# EAGLE design r162dl (EAGLE 5.09)
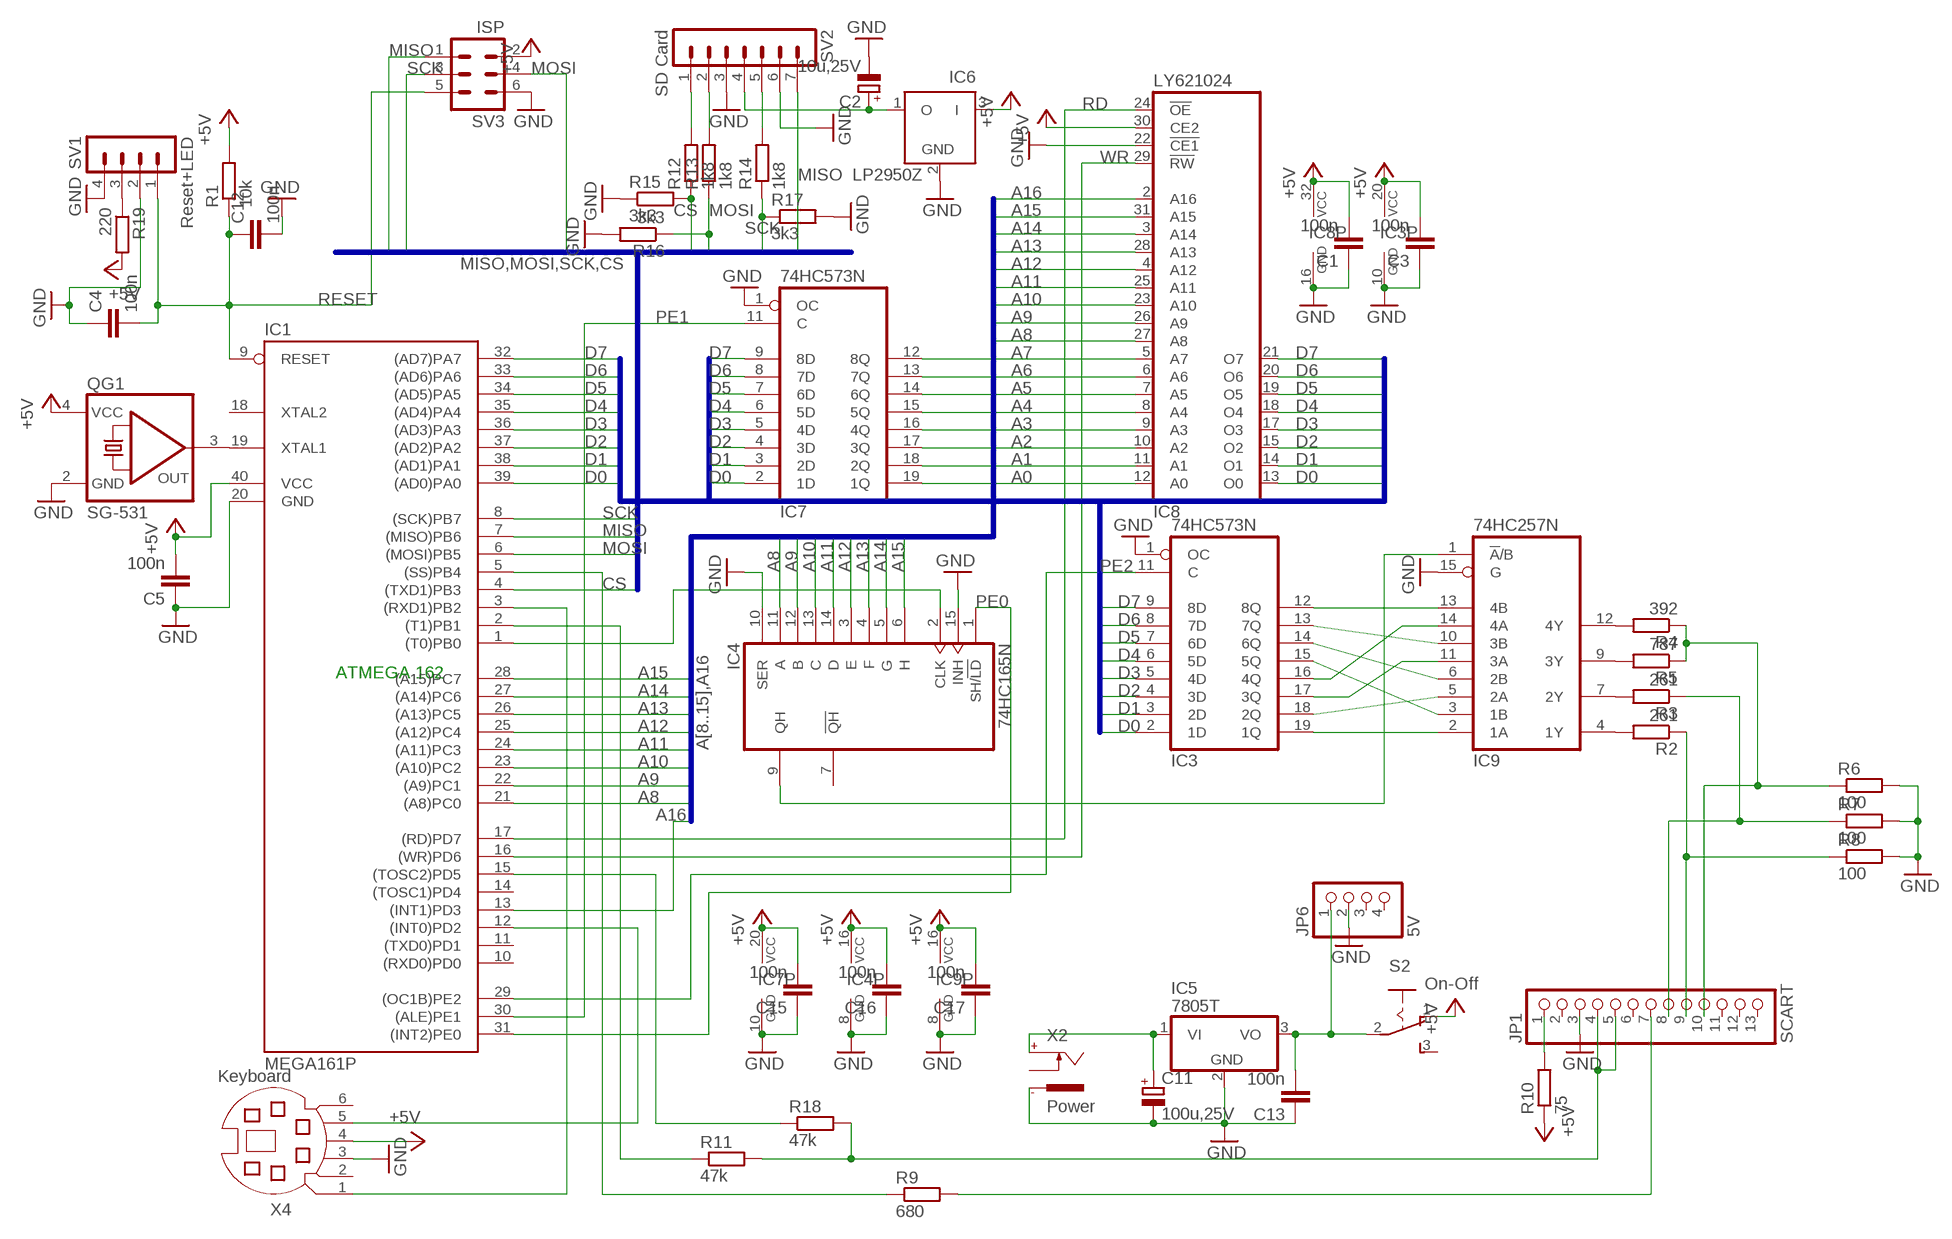
[diagram p0: schematic, sheet 1]

## Parts
C1  100n  C5/3  [C5B3]
C2  10u,25V  CPOL-EUB45181B  [B45181B]
C3  100n  C5/3  [C5B3]
C4  100n  C5/3  [C5B3]
C5  100n  C5/3  [C5B3]
C11  100u,25V  CPOL-EUB45181B  [B45181B]
C12  100n  C5/3  [C5B3]
C13  100n  C5/3  [C5B3]
C15  100n  C5/3  [C5B3]
C16  100n  C5/3  [C5B3]
C17  100n  C5/3  [C5B3]
IC1  MEGA161P  [DIL40]
IC3  74HC573N  [DIL20]
IC4  74HC165N  [DIL16]
IC5  7805T  [TO220H]
IC6  LP2950Z  [TO92]
IC7  74HC573N  [DIL20]
IC8  LY621024  TC551001CP  [DIL32]
IC9  74HC257N  [DIL16]
JP1  SCART  PINHD-1X13_2.00  [1X13M]
JP6  5V  PINHD-1X04_2.54  [1X04]
QG1  SG-531  SG531  [DIL08-4]
R1  10k  R-EU_0207/12  [0207/12]
R2  261  R-EU_0207/12  [0207/12]
R3  261  R-EU_0207/12  [0207/12]
R4  392  R-EU_0207/12  [0207/12]
R5  787  R-EU_0207/12  [0207/12]
R6  100  R-EU_0207/12  [0207/12]
R7  100  R-EU_0207/12  [0207/12]
R8  100  R-EU_0207/12  [0207/12]
R9  680  R-EU_0207/12  [0207/12]
R10  75  R-EU_0207/12  [0207/12]
R11  47k  R-EU_0207/12  [0207/12]
R12  1k8  R-EU_0207/12  [0207/12]
R13  1k8  R-EU_0207/12  [0207/12]
R14  1k8  R-EU_0207/12  [0207/12]
R15  3k3  R-EU_0207/12  [0207/12]
R16  3k3  R-EU_0207/12  [0207/12]
R17  3k3  R-EU_0207/12  [0207/12]
R18  47k  R-EU_0207/12  [0207/12]
R19  220  R-EU_0207/12  [0207/12]
S2  On-Off  M251  [M251]
SV1  Reset+LED  MA04-1  [MA04-1]
SV2  SD Card  MA07-1  [MA07-1]
SV3  ISP  MA03-2  [MA03-2]
X2  Power  737992-55  [737992-5]
X4  Keyboard  MD06SS  [MDIN06SS]

## Nets
+5V [power]: C1.2 C3.2 C5.2 C15.2 C16.2 C17.2 IC1.40(VCC) IC3.20(VCC) IC4.16(VCC) IC6.3(I) IC7.20(VCC) IC8.30(CE2) IC8.32(VCC) IC9.16(VCC) QG1.4(VCC) R1.2 R10.1 R19.2 S2.1(O) SV3.2 X4.4
A0: IC7.19(1Q) IC8.12(A0)
A1: IC7.18(2Q) IC8.11(A1)
A2: IC7.17(3Q) IC8.10(A2)
A3: IC7.16(4Q) IC8.9(A3)
A4: IC7.15(5Q) IC8.8(A4)
A5: IC7.14(6Q) IC8.7(A5)
A6: IC7.13(7Q) IC8.6(A6)
A7: IC7.12(8Q) IC8.5(A7)
A8: IC1.21((A8)PC0) IC4.11(A) IC8.27(A8)
A9: IC1.22((A9)PC1) IC4.12(B) IC8.26(A9)
A10: IC1.23((A10)PC2) IC4.13(C) IC8.23(A10)
A11: IC1.24((A11)PC3) IC4.14(D) IC8.25(A11)
A12: IC1.25((A12)PC4) IC4.3(E) IC8.4(A12)
A13: IC1.26((A13)PC5) IC4.4(F) IC8.28(A13)
A14: IC1.27((A14)PC6) IC4.5(G) IC8.3(A14)
A15: IC1.28((A15)PC7) IC4.6(H) IC8.31(A15)
A16: IC1.13((INT1)PD3) IC8.2(A16)
AUDIO: JP1.4 JP1.5 R11.2 R18.2
BLUE: JP1.10 R4.1 R5.1 R6.1
CS: IC1.4((TXD1)PB3) R12.1 R15.2
CS1: R12.2 SV2.1
D0: IC1.39((AD0)PA0) IC3.2(1D) IC7.2(1D) IC8.13(O0)
D1: IC1.38((AD1)PA1) IC3.3(2D) IC7.3(2D) IC8.14(O1)
D2: IC1.37((AD2)PA2) IC3.4(3D) IC7.4(3D) IC8.15(O2)
D3: IC1.36((AD3)PA3) IC3.5(4D) IC7.5(4D) IC8.17(O3)
D4: IC1.35((AD4)PA4) IC3.6(5D) IC7.6(5D) IC8.18(O4)
D5: IC1.34((AD5)PA5) IC3.7(6D) IC7.7(6D) IC8.19(O5)
D6: IC1.33((AD6)PA6) IC3.8(7D) IC7.8(7D) IC8.20(O6)
D7: IC1.32((AD7)PA7) IC3.9(8D) IC7.9(8D) IC8.21(O7)
GND [power]: C1.1 C2.- C3.1 C4.1 C5.1 C11.- C12.2 C13.1 C15.1 C16.1 C17.1 IC1.20(GND) IC3.1(OC) IC3.10(GND) IC4.8(GND) IC4.10(SER) IC4.15(INH) IC5.2(GND) IC6.2(GND) IC7.1(OC) IC7.10(GND) IC8.16(GND) IC8.22(!CE1) IC9.8(GND) IC9.15(G) JP1.3 JP6.2 QG1.2(GND) R6.2 R7.2 R8.2 R15.1 R16.2 R17.2 SV1.2 SV1.4 SV2.3 SV2.6 SV3.6 X2.-1 X4.3
GREEN: JP1.8 R3.1 R7.1
KBDCLK: IC1.12((INT0)PD2) X4.5
KBDDATA: IC1.3((RXD1)PB2) X4.1
MISO: IC1.7((MISO)PB6) SV2.7 SV3.1
MOSI: IC1.6((MOSI)PB5) R13.1 R16.1 SV3.4
MOSI1: R13.2 SV2.2
N$1 [power]: C11.+ IC5.1(VI) X2.+
N$2: JP1.1 R10.2
N$3: R19.1 SV1.3
N$4: IC1.5((SS)PB4) R9.1
N$5 [power]: C13.2 IC5.3(VO) JP6.1 S2.2(P)
N$7: IC4.9(QH) IC9.1(!A!/B)
N$9: IC1.19(XTAL1) QG1.3(OUT)
N$10: IC3.19(1Q) IC9.2(1A)
N$11: IC1.1((T0)PB0) IC4.2(CLK)
N$12: IC1.2((T1)PB1) R11.1
N$15: IC3.18(2Q) IC9.5(2A)
N$20: IC3.17(3Q) IC9.11(3A)
N$21: IC3.16(4Q) IC9.14(4A)
N$22: IC3.15(5Q) IC9.3(1B)
N$23: IC3.14(6Q) IC9.6(2B)
N$24: IC3.13(7Q) IC9.10(3B)
N$25: IC3.12(8Q) IC9.13(4B)
N$26: IC9.4(1Y) R2.2
N$27: IC9.7(2Y) R3.2
N$29: IC9.9(3Y) R5.2
N$30: IC9.12(4Y) R4.2
PE0: IC1.31((INT2)PE0) IC4.1(SH/!LD)
PE1: IC1.30((ALE)PE1) IC7.11(C)
PE2: IC1.29((OC1B)PE2) IC3.11(C)
RD: IC1.17((RD)PD7) IC8.24(!OE)
RED: JP1.9 R2.1 R8.1
RESET: C4.2 C12.1 IC1.9(RESET) R1.1 SV1.1 SV3.5
S0: IC1.15((TOSC2)PD5) R18.1
SCK: IC1.8((SCK)PB7) R14.1 R17.1 SV3.3
SCK1: R14.2 SV2.5
SYNC: JP1.7 R9.2
V33: C2.+ IC6.1(O) SV2.4
WR: IC1.16((WR)PD6) IC8.29(!RW)
Unconnected: IC1.10((RXD0)PD0) IC1.11((TXD0)PD1) IC1.14((TOSC1)PD4) IC1.18(XTAL2) IC4.7(!QH) IC8.1(NC) JP1.2 JP1.6 JP1.11 JP1.12 JP1.13 JP6.3 JP6.4 S2.3(S) X2.-2 X2.K X4.2 X4.6

## Buses
A[8..15],A16
D[0..7]
MISO,MOSI,SCK,CS

## Notes on the sheet
- ATMEGA 162

## Library data of the parts
C1 C3-C5 C12 C13 C15-C17 = capacitor-wima:C: CAPACITOR naming: grid - package width
C2 C11 = rcl:CPOL-EU: POLARIZED CAPACITOR, European symbol
IC1 = atmel:MEGA161*P: MICROCONTROLLER 16 Kbytes FLASH 512 bytes EEPROM 1 Kbytes SRAM dual UART hardware multiplier Source: avr.lbr
IC3 IC7 = 74xx-eu:74*573: 8-bit D latch BUS DRIVER
IC4 = 74xx-eu:74*165: 8-bit parallel load SHIFT REGISTER
IC5 = linear:78*: Positive VOLTAGE REGULATOR Source: http://cache.national.com/ds/LM/LM78L05.pdf http://www.fairchildsemi.com/ds/LM/LM7805.pdf
IC6 = linear:LP2950: 100 mA, Low Power Low Dropout Voltage Regulator Source: http://www.onsemi.com/pub/Collateral/LP2950-D.PDF
IC8 = memory:TC551001CP: MEMORY
IC9 = 74xx-eu:74*257: Quadruple 2-to 1 line data SELECTOR/MULTIPLEXER
JP1 = pinhead-2:PINHD-1X13: PIN HEADER
JP6 = pinhead-2:PINHD-1X04: PIN HEADER
QG1 = crystal:SG531: CRYSTAL RESONATOR
R1-R19 = rcl:R-EU_: RESISTOR, European symbol
S2 = switch:M251: SLIDING SWITCH Mors, distributor Buerklin, 11G702
SV1 = con-lstb:MA04-1: PIN HEADER
SV2 = con-lstb:MA07-1: PIN HEADER
SV3 = con-lstb:MA03-2: PIN HEADER
X2 = con-conrad:737992-55: FEMALE PRINT CONNECTOR DIN 45323 (34V/3A), ROKA, distributor Conrad
X4 = con-yamaichi:MD06SS: YAMAICHI CONNECTOR

## Net classes
0 default: width 0.152 mm, drill 0.305 mm, clearance 0.152 mm
1 power: width 0.711 mm, drill 0.305 mm, clearance 0.203 mm

## Board
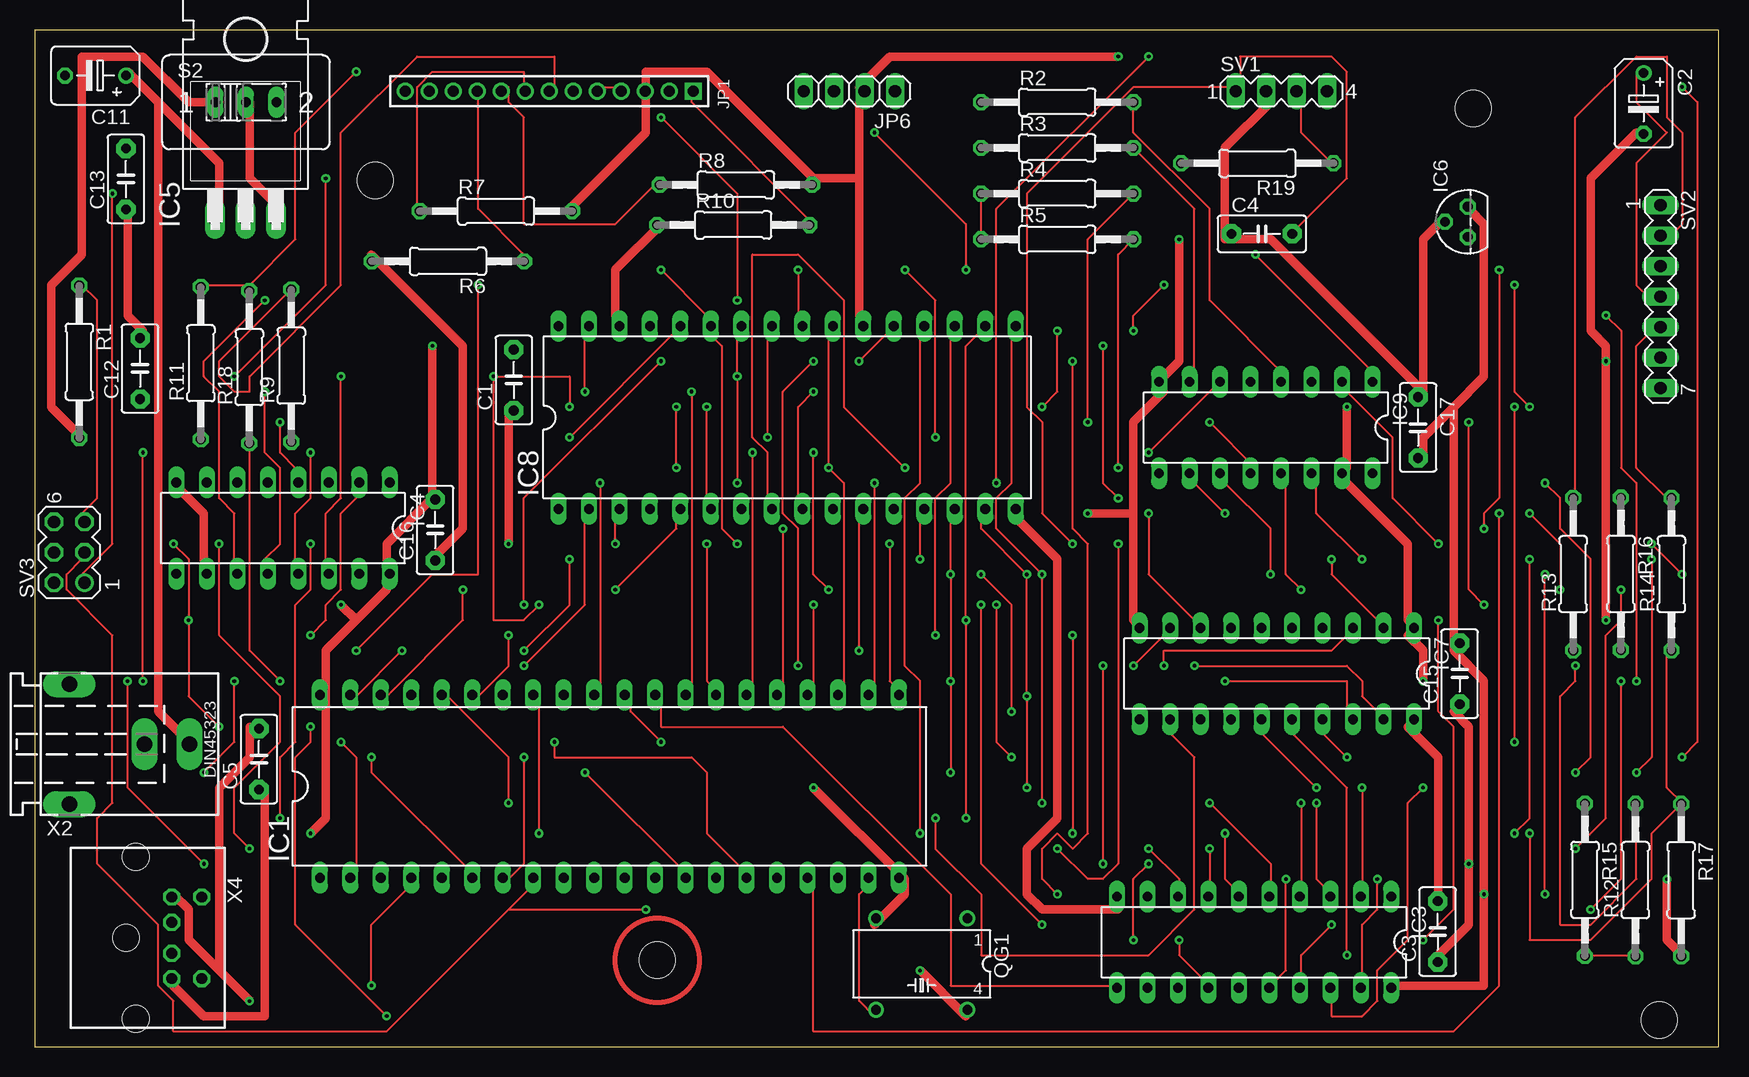
[diagram p1: board, top side]
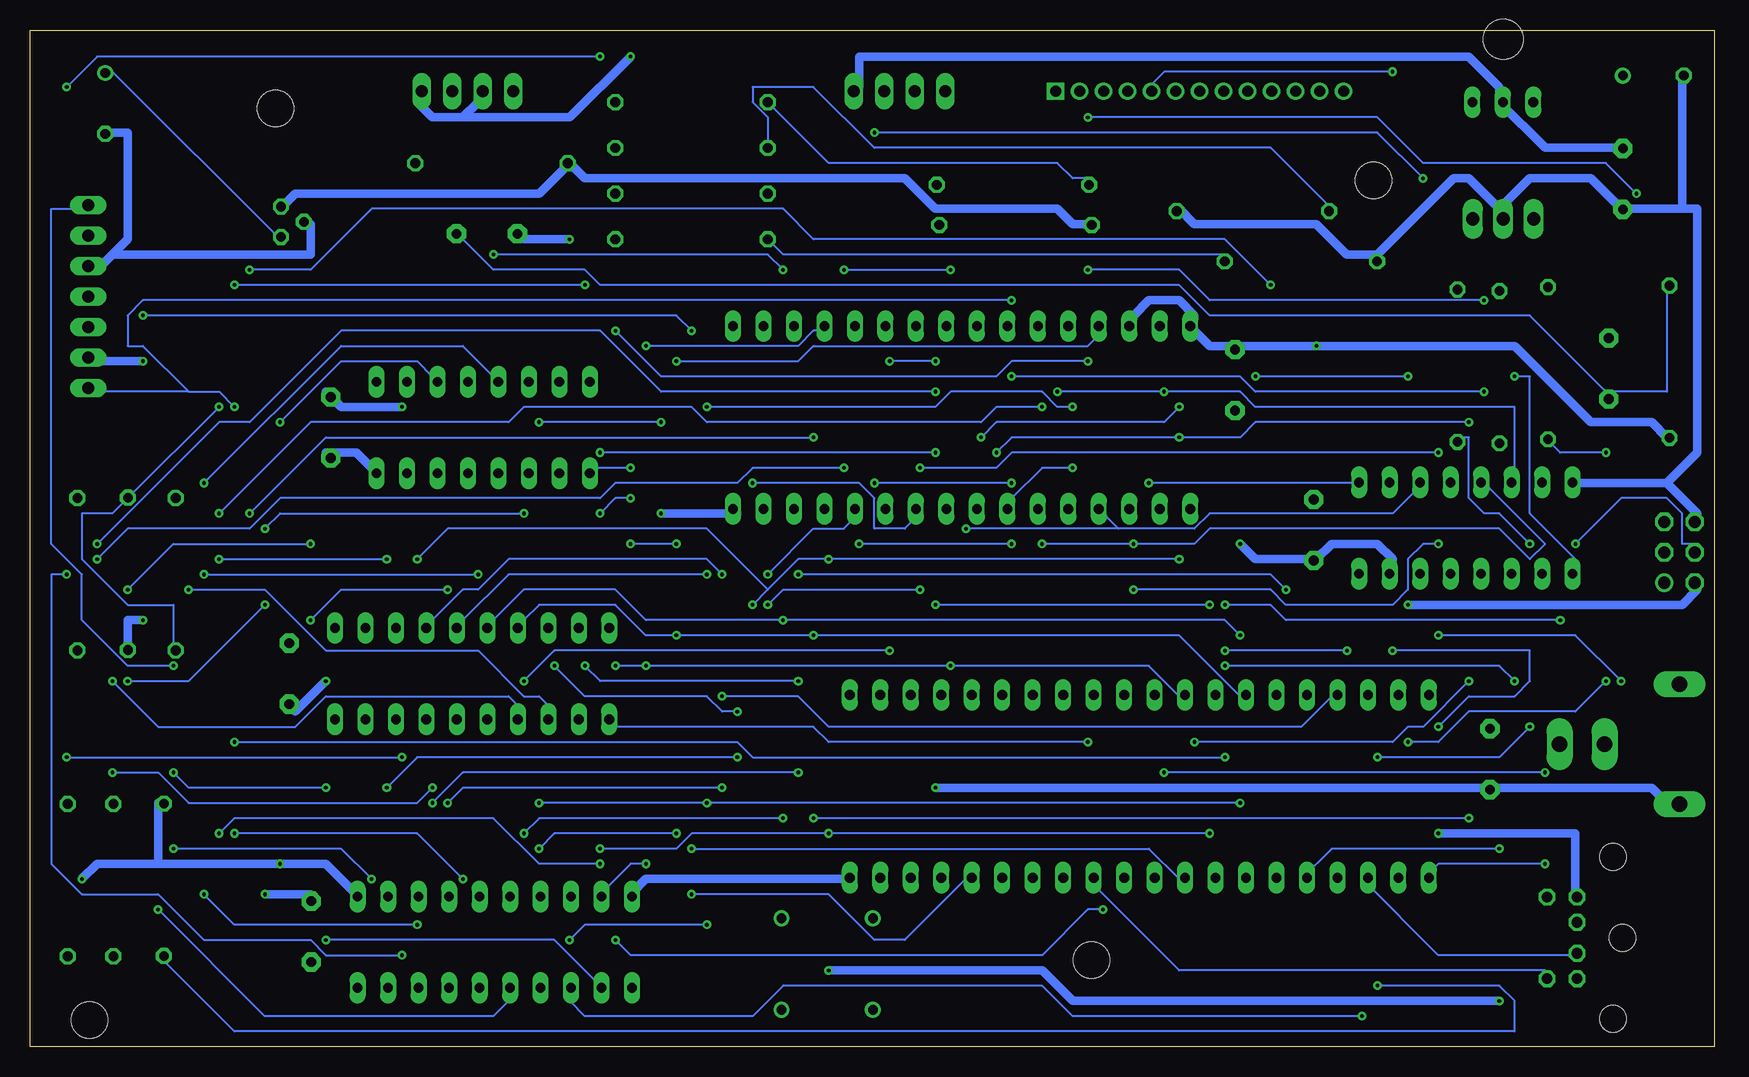
[diagram p2: board, bottom side, seen from below]

Size 140.36 x 84.76 mm. Coordinates in mm from the lower left corner, seen from the top.
Outline: 0,0 140.36,0 140.36,84.76 0,84.76 0,0
Copper layers (1*16): Top 0.035mm / dielectric 1.5mm / Bottom 0.035mm
Design rules "default *": minimum track width 6mil, minimum drill 12mil, track to track 6mil, track to pad 6mil, pad to pad 6mil, via to via 6mil, smd to smd 6mil, copper to edge 40mil, drill to drill 8mil, minimum pad ring 10mil, minimum via ring 8mil, stop-mask expansion 4mil, vias tented up to drill 0mil, thermal gap 10mil
Holes 3 mm at 51.9,7.21 119.9,78.21 28.4,72.21 135.4,2.21

### Footprints (pad centres in the part's own frame; a part is rotated, then mirrored left to right if it is on the bottom)
C5B3 = drill 0.813 pad 1.6 octagon: 1 -2.54,0; 2 2.54,0
B45181B = drill 0.813 round: + -2.54,0 | drill 0.813 octagon: - 2.54,0
DIL40 = drill 0.813 long: 1 -24.13,-7.62; 2 -21.59,-7.62; 3 -19.05,-7.62; 4 -16.51,-7.62; 5 -13.97,-7.62; 6 -11.43,-7.62; 7 -8.89,-7.62; 8 -6.35,-7.62; 9 -3.81,-7.62; 10 -1.27,-7.62; 11 1.27,-7.62; 12 3.81,-7.62; 13 6.35,-7.62; 14 8.89,-7.62; 15 11.43,-7.62; 16 13.97,-7.62; 17 16.51,-7.62; 18 19.05,-7.62; 19 21.59,-7.62; 20 24.13,-7.62; 21 24.13,7.62; 22 21.59,7.62; 23 19.05,7.62; 24 16.51,7.62; 25 13.97,7.62; 26 11.43,7.62; 27 8.89,7.62; 28 6.35,7.62; 29 3.81,7.62; 30 1.27,7.62; 31 -1.27,7.62; 32 -3.81,7.62; 33 -6.35,7.62; 34 -8.89,7.62; 35 -11.43,7.62; 36 -13.97,7.62; 37 -16.51,7.62; 38 -19.05,7.62; 39 -21.59,7.62; 40 -24.13,7.62
DIL20 = drill 0.813 long: 1 -11.43,-3.81; 2 -8.89,-3.81; 3 -6.35,-3.81; 4 -3.81,-3.81; 5 -1.27,-3.81; 6 1.27,-3.81; 7 3.81,-3.81; 8 6.35,-3.81; 9 8.89,-3.81; 10 11.43,-3.81; 11 11.43,3.81; 12 8.89,3.81; 13 6.35,3.81; 14 3.81,3.81; 15 1.27,3.81; 16 -1.27,3.81; 17 -3.81,3.81; 18 -6.35,3.81; 19 -8.89,3.81; 20 -11.43,3.81
DIL16 = drill 0.813 long: 1 -8.89,-3.81; 2 -6.35,-3.81; 3 -3.81,-3.81; 4 -1.27,-3.81; 5 1.27,-3.81; 6 3.81,-3.81; 7 6.35,-3.81; 8 8.89,-3.81; 9 8.89,3.81; 10 6.35,3.81; 11 3.81,3.81; 12 1.27,3.81; 13 -1.27,3.81; 14 -3.81,3.81; 15 -6.35,3.81; 16 -8.89,3.81
TO220H = drill 1.118 long: 1 -2.54,-10.16; 2 0,-10.16; 3 2.54,-10.16 | hole 3.302: 0,4.826
TO92 = drill 0.813 octagon: 1 -1.27,0; 2 0,1.905; 3 1.27,0
DIL32 = drill 0.813 long: 1 -19.05,-7.62; 2 -16.51,-7.62; 3 -13.97,-7.62; 4 -11.43,-7.62; 5 -8.89,-7.62; 6 -6.35,-7.62; 7 -3.81,-7.62; 8 -1.27,-7.62; 9 1.27,-7.62; 10 3.81,-7.62; 11 6.35,-7.62; 12 8.89,-7.62; 13 11.43,-7.62; 14 13.97,-7.62; 15 16.51,-7.62; 16 19.05,-7.62; 17 19.05,7.62; 18 16.51,7.62; 19 13.97,7.62; 20 11.43,7.62; 21 8.89,7.62; 22 6.35,7.62; 23 3.81,7.62; 24 1.27,7.62; 25 -1.27,7.62; 26 -3.81,7.62; 27 -6.35,7.62; 28 -8.89,7.62; 29 -11.43,7.62; 30 -13.97,7.62; 31 -16.51,7.62; 32 -19.05,7.62
1X13M = drill 0.914 square: 1 -12,0 | drill 0.914 round: 2 -10,0; 3 -8,0; 4 -6,0; 5 -4,0; 6 -2,0; 7 0,0; 8 2,0; 9 4,0; 10 6,0; 11 8,0; 12 10,0; 13 12,0
1X04 = drill 1.016 long: 1 -3.81,0; 2 -1.27,0; 3 1.27,0; 4 3.81,0
DIL08-4 = drill 0.813 round: 1 -3.81,-3.81; 2 3.81,-3.81; 3 3.81,3.81; 4 -3.81,3.81
0207/12 = drill 0.813 octagon: 1 -6.35,0; 2 6.35,0
M251 = drill 0.813 long: 1 -2.54,0; 2 0,0; 3 2.54,0
MA04-1 = drill 1.016 long: 1 -3.81,0; 2 -1.27,0; 3 1.27,0; 4 3.81,0
MA07-1 = drill 1.016 long: 1 -7.62,0; 2 -5.08,0; 3 -2.54,0; 4 0,0; 5 2.54,0; 6 5.08,0; 7 7.62,0
MA03-2 = drill 1.016 round: 1 -2.54,-1.27 | drill 1.016 octagon: 2 -2.54,1.27; 3 0,-1.27; 4 0,1.27; 5 2.54,-1.27; 6 2.54,1.27
737992-5 = drill 1.3 pad 2.184 long: + 0,10; -1 5,0; -2 -5,0; K 0,6.25
MDIN06SS = drill 0.9 octagon: 1 1.3,8.5; 2 -1.3,8.5; 3 3.4,8.5; 4 -3.4,8.5; 5 3.4,11; 6 -3.4,11 | hole 2.2: -6.75,5.5; 0,4.7; 6.75,5.5

### Placement (x,y rotation side)
C1  39.94,55.58 90 top
C2  134.09,78.64 270 top
C3  116.93,9.59 90 top
C4  102.28,67.77 0 top
C5  18.7,23.97 90 top
C11  5.08,80.96 180 top
C12  8.8,56.53 90 top
C13  7.62,72.34 90 top
C15  118.76,31.1 90 top
C16  33.39,43.07 90 top
C17  115.3,51.62 270 top
IC1  47.91,21.7 0 top
IC3  101.63,8.71 180 top
IC4  20.71,43.23 180 top
IC5  17.59,79.17 0 top
IC6  119.44,68.77 90 top
IC7  103.52,31.1 180 top
IC8  62.72,52.45 0 top
IC9  102.6,51.62 180 top
JP1  42.9,79.65 180 top
JP6  67.9,79.65 180 top
QG1  73.93,6.89 180 top
R1  3.73,57.1 270 top
R2  85.23,78.74 0 top
R3  85.23,74.93 0 top
R4  85.23,71.12 0 top
R5  85.23,67.31 0 top
R6  34.45,65.47 180 top
R7  38.45,69.66 0 top
R8  58.45,71.85 0 top
R9  21.4,56.77 90 top
R10  58.23,68.5 0 top
R11  13.86,56.98 90 top
R12  133.41,13.88 90 top
R13  128.22,39.39 90 top
R14  136.41,39.39 90 top
R15  129.2,13.91 270 top
R16  132.2,39.42 270 top
R17  137.22,13.88 270 top
R18  17.9,56.65 90 top
R19  101.9,73.65 180 top
S2  17.62,78.74 0 top
SV1  103.9,79.65 0 top
SV2  135.5,62.53 270 top
SV3  2.9,41.21 90 top
X2  2.9,25.21 270 top
X4  2.94,9.07 270 top

### Tracks (layer width: path | path; a pad name or v marks a point on that pad's centre or on a via)
+5V  (via drill 0.3)
  Top 0.711: IC7.20 114.44,26.67 116.98,24.13 116.98,12.7 C3.2 | 118.25,33.02 120.79,30.48 v120.79,12.7 120.79,5.08 113.17,5.08 IC3.20 | 118.25,53.34 115.71,50.8 115.71,49.53 C17.2 | 118.25,53.34 120.79,55.88 120.79,68.58 119.52,69.85 IC6.3 | 118.25,53.34 118.25,33.02 | 118.25,33.02 C15.2 | v73.8,6.35 77.61,2.54 QG1.4 | 15.38,6.35 12.84,8.89 12.84,11.43 11.57,12.7 X4.4 | 15.38,6.35 v17.92,3.81 | 15.38,6.35 15.38,21.59 17.92,24.13 17.92,26.67 C5.2 | 24.27,29.21 24.27,33.02 26.81,35.56 | 26.81,35.56 29.35,38.1 29.35,39.37 IC4.16 29.35,40.64 29.35,41.91 33.16,45.72 | 26.81,35.56 v25.54,36.83 | 15.38,78.74 S2.1 12.84,78.74 9.03,82.55 3.95,82.55 3.95,66.04 1.41,63.5 1.41,53.34 3.95,50.8 R1.2 | R10.1 52.21,68.58 48.4,64.77 48.4,60.96 IC8.30 | 33.16,45.72 v33.16,58.42 | 33.16,45.72 C16.2 | v23,17.78 24.27,19.05 24.27,29.21 | 24.27,29.21 IC1.40
  Bottom 0.711: v120.79,12.7 116.98,12.7 C3.2 | IC9.16 111.9,48.26 113.17,49.53 115.71,49.53 C17.2 | 95.39,73.66 97.93,71.12 118.25,71.12 119.52,69.85 IC6.3 | v73.8,6.35 56.02,6.35 53.48,3.81 v17.92,3.81 | v25.54,36.83 2.68,36.83 1.41,38.1 SV3.2 | 39.51,58.42 v33.16,58.42 16.65,58.42 10.3,52.07 5.22,52.07 3.95,50.8 R1.2 | 39.51,58.42 42.05,58.42 43.32,59.69 IC8.32 43.32,60.96 44.59,62.23 47.13,62.23 48.4,60.96 IC8.30 | 39.51,58.42 C1.2 | v23,17.78 11.57,17.78 11.57,12.7 X4.4 | 95.39,73.66 94.12,72.39 67.45,72.39 64.91,69.85 54.75,69.85 53.48,68.58 52.21,68.58 R10.1 | 95.39,73.66 R19.2
A0  (via drill 0.3)
  Top 0.152: v96.66,31.75 109.36,31.75 110.63,30.48 110.63,29.21 111.9,27.94 IC7.19 | v81.42,27.94 81.42,36.83 v78.88,39.37
  Bottom 0.152: v96.66,31.75 94.12,29.21 83.96,29.21 82.69,27.94 v81.42,27.94 | v78.88,39.37 75.07,43.18 72.53,43.18 71.26,44.45 IC8.12
A1  (via drill 0.3)
  Top 0.152: v68.72,33.02 68.72,44.45 IC8.11 | v99.2,30.48 109.36,30.48 109.36,27.94 IC7.18
  Bottom 0.152: v68.72,33.02 96.66,33.02 v99.2,30.48
A2  (via drill 0.3)
  Top 0.152: v109.36,24.13 106.82,26.67 IC7.17 | v137.3,24.13 138.57,25.4 138.57,78.74 v137.3,80.01 | v92.85,82.55 80.15,69.85 v80.15,46.99
  Bottom 0.152: v137.3,24.13 v109.36,24.13 | v137.3,80.01 134.76,82.55 v92.85,82.55 | v80.15,46.99 71.26,46.99 69.99,45.72 69.99,43.18 67.45,43.18 66.18,44.45 IC8.10
A3  (via drill 0.3)
  Top 0.152: v109.36,7.62 109.36,21.59 104.28,26.67 IC7.16 | v134.76,41.91 v137.3,39.37 | v64.91,54.61 63.64,53.34 63.64,45.72 IC8.9
  Bottom 0.152: v109.36,7.62 115.71,7.62 116.98,8.89 125.87,8.89 129.68,12.7 136.03,12.7 138.57,15.24 138.57,39.37 v137.3,39.37 | v134.76,41.91 124.6,52.07 122.06,52.07 114.44,59.69 92.85,59.69 87.77,54.61 v64.91,54.61
A4  (via drill 0.3)
  Top 0.152: v106.82,21.59 101.74,26.67 IC7.15 | v133.49,22.86 134.76,24.13 v134.76,40.64 | v72.53,48.26 67.45,53.34 67.45,62.23 63.64,66.04 59.83,66.04 59.83,50.8 61.1,49.53 61.1,45.72 IC8.8
  Bottom 0.152: v106.82,21.59 108.09,20.32 127.14,20.32 129.68,22.86 v133.49,22.86 | v134.76,40.64 132.22,43.18 122.06,43.18 119.52,45.72 92.85,45.72 91.58,46.99 81.42,46.99 80.15,48.26 v72.53,48.26
A5  (via drill 0.3)
  Top 0.152: v53.48,48.26 v53.48,53.34 | v83.96,53.34 85.23,54.61 v85.23,59.69 | v130.95,60.96 132.22,59.69 132.22,48.26 133.49,46.99 v133.49,30.48
  Bottom 0.152: v53.48,48.26 56.02,48.26 58.56,45.72 IC8.7 | v53.48,53.34 54.75,53.34 56.02,54.61 63.64,54.61 64.91,53.34 v83.96,53.34 | v85.23,59.69 86.5,60.96 v130.95,60.96 | v133.49,30.48 129.68,26.67 118.25,26.67 115.71,29.21 100.47,29.21 99.2,27.94 IC7.14
A6  (via drill 0.3)
  Top 0.152: v127.14,38.1 127.14,41.91 v124.6,44.45 | v56.02,53.34 56.02,45.72 IC8.6
  Bottom 0.152: v127.14,38.1 120.79,38.1 115.71,33.02 103.01,33.02 99.2,29.21 97.93,29.21 96.66,27.94 IC7.13 | v124.6,44.45 116.98,52.07 100.47,52.07 99.2,53.34 85.23,53.34 83.96,52.07 61.1,52.07 59.83,53.34 v56.02,53.34
A7  (via drill 0.3)
  Top 0.152: v75.07,19.05 75.07,16.51 78.88,12.7 78.88,7.62 92.85,7.62 96.66,11.43 96.66,24.13 94.12,26.67 IC7.12 | v20.46,19.05 20.46,24.13 21.73,25.4 21.73,36.83 23,38.1 v23,41.91 | v48.4,38.1 53.48,43.18 53.48,44.45 IC8.5
  Bottom 0.152: v20.46,19.05 v75.07,19.05 | v23,41.91 24.27,41.91 25.54,40.64 25.54,38.1 26.81,36.83 35.7,36.83 36.97,38.1 v48.4,38.1
A8  (via drill 0.3)
  Top 0.152: v19.19,62.23 14.11,57.15 14.11,55.88 15.38,54.61 15.38,45.72 16.65,44.45 16.65,40.64 IC4.11 | v52.21,64.77 56.02,60.96 IC8.27 56.02,59.69 57.29,58.42 57.29,43.18 v58.56,41.91 | v71.26,41.91 71.26,30.48 72.53,29.21 IC1.21
  Bottom 0.152: v19.19,62.23 42.05,62.23 44.59,64.77 v52.21,64.77 | v58.56,41.91 v71.26,41.91
A9  (via drill 0.3)
  Top 0.152: v19.19,54.61 19.19,49.53 20.46,48.26 20.46,41.91 19.19,40.64 IC4.12 | IC8.26 58.56,59.69 v58.56,55.88 v58.56,46.99 | v69.99,46.99 69.99,29.21 IC1.22
  Bottom 0.152: v19.19,54.61 38.24,54.61 39.51,55.88 v58.56,55.88 | v58.56,46.99 v69.99,46.99
A10  (via drill 0.3)
  Top 0.152: v23,49.53 23,45.72 21.73,44.45 21.73,40.64 IC4.13 | IC8.23 66.18,59.69 v66.18,48.26 67.45,46.99 67.45,29.21 IC1.23
  Bottom 0.152: v23,49.53 58.56,49.53 59.83,48.26 v66.18,48.26
A11  (via drill 0.3)
  Top 0.152: v25.54,55.88 25.54,45.72 24.27,44.45 24.27,40.64 IC4.14 | v44.59,53.34 44.59,55.88 v38.24,55.88 38.24,35.56 40.78,35.56 v42.05,36.83 | v61.1,50.8 61.1,59.69 IC8.25 | v64.91,36.83 64.91,29.21 IC1.24
  Bottom 0.152: v25.54,55.88 v38.24,55.88 | v44.59,53.34 45.86,52.07 59.83,52.07 v61.1,50.8 | v42.05,36.83 v64.91,36.83
A12  (via drill 0.3)
  Top 0.152: v62.37,43.18 62.37,29.21 IC1.25
  Bottom 0.152: 49.67,43.18 43.32,43.18 42.05,44.45 26.81,44.45 24.27,46.99 IC4.3 | 49.67,43.18 50.94,44.45 IC8.4 | 49.67,43.18 v62.37,43.18
A13  (via drill 0.3)
  Top 0.152: v20.46,52.07 20.46,49.53 21.73,48.26 IC4.4 | v44.59,50.8 53.48,59.69 IC8.28 | v59.83,49.53 59.83,29.21 IC1.26
  Bottom 0.152: v20.46,52.07 38.24,52.07 39.51,50.8 v44.59,50.8 58.56,50.8 v59.83,49.53
A14  (via drill 0.3)
  Top 0.152: v48.4,41.91 48.4,44.45 IC8.3 | v56.02,41.91 56.02,30.48 57.29,29.21 IC1.27
  Bottom 0.152: IC4.5 19.19,46.99 14.11,41.91 15.38,40.64 17.92,43.18 42.05,43.18 43.32,41.91 v48.4,41.91 v56.02,41.91
A15  (via drill 0.3)
  Top 0.152: v45.86,54.61 45.86,59.69 IC8.31 | v54.75,54.61 54.75,29.21 IC1.28
  Bottom 0.152: IC4.6 16.65,48.26 16.65,53.34 38.24,53.34 39.51,54.61 v45.86,54.61 v54.75,54.61
A16  (via drill 0.3)
  Top 0.152: v45.86,22.86 54.75,13.97 IC1.13 | v14.11,22.86 16.65,25.4 v16.65,30.48 | v40.78,31.75 45.86,36.83 45.86,44.45 IC8.2
  Bottom 0.152: v14.11,22.86 v45.86,22.86 | v16.65,30.48 17.92,31.75 v40.78,31.75
AUDIO  (via drill 0.3)
  Top 0.152: JP1.5 47.13,80.01 48.4,80.01 JP1.4 | 17.92,63.5 14.11,63.5 R11.2 | v26.81,81.28 21.73,76.2 21.73,67.31 17.92,63.5 | 17.92,63.5 R18.2
  Bottom 0.152: v26.81,81.28 45.86,81.28 47.13,80.01 JP1.5
BLUE
  Top 0.152: R5.1 R4.1 | R6.1 40.78,66.04 36.97,69.85 36.97,80.01 JP1.10
  Bottom 0.152: R5.1 77.61,66.04 40.78,66.04 R6.1
CS  (via drill 0.3)
  Top 0.152: R12.1 133.49,7.62 129.68,7.62 R15.2 | v28.08,5.08 28.08,10.16 31.89,13.97 IC1.4
  Bottom 0.152: v28.08,5.08 17.92,5.08 16.65,3.81 16.65,1.27 123.33,1.27 129.68,7.62 R15.2
CS1  (via drill 0.3)
  Top 0.152: v128.41,31.75 128.41,30.48 127.14,29.21 127.14,10.16 129.68,10.16 133.49,13.97 133.49,20.32 R12.2
  Bottom 0.152: v128.41,31.75 132.22,31.75 136.03,35.56 136.03,39.37 138.57,41.91 138.57,69.85 136.03,69.85 SV2.1
D0  (via drill 0.3)
  Top 0.152: v30.62,33.02 26.81,29.21 IC1.39 | v40.78,33.02 44.59,36.83 v44.59,40.64 | v73.8,40.64 73.8,44.45 IC8.13 | v110.63,21.59 110.63,12.7 IC3.2 | v81.42,24.13 80.15,25.4 v80.15,36.83 | v108.09,40.64 108.09,39.37 111.9,35.56 IC7.2
  Bottom 0.152: v30.62,33.02 v40.78,33.02 | v44.59,40.64 v73.8,40.64 76.34,40.64 78.88,38.1 | v110.63,21.59 108.09,24.13 v81.42,24.13 | 78.88,38.1 v80.15,36.83 | v108.09,40.64 105.55,43.18 83.96,43.18 78.88,38.1
D1  (via drill 0.3)
  Top 0.152: v35.7,38.1 35.7,35.56 29.35,29.21 IC1.38 | IC8.14 76.34,44.45 v76.34,39.37 v76.34,30.48 v76.34,22.86 | v106.82,20.32 106.82,13.97 108.09,12.7 IC3.3 | v94.12,31.75 94.12,33.02 108.09,33.02 109.36,34.29 IC7.3
  Bottom 0.152: v35.7,38.1 36.97,39.37 v76.34,39.37 | v106.82,20.32 104.28,22.86 v76.34,22.86 | v94.12,31.75 92.85,30.48 v76.34,30.48
D2  (via drill 0.3)
  Top 0.152: v105.55,20.32 105.55,12.7 IC3.4 | v82.69,21.59 v82.69,29.21 v82.69,39.37 78.88,43.18 78.88,44.45 IC8.15
  Bottom 0.152: v105.55,20.32 104.28,21.59 v82.69,21.59 | v82.69,29.21 76.34,29.21 73.8,26.67 34.43,26.67 31.89,29.21 IC1.37 | v82.69,39.37 83.96,40.64 100.47,40.64 103.01,38.1 104.28,38.1 106.82,35.56 IC7.4
D3  (via drill 0.3)
  Top 0.152: v39.51,20.32 39.51,24.13 34.43,29.21 IC1.36 | v97.93,20.32 103.01,15.24 103.01,12.7 IC3.5 | v83.96,20.32 v83.96,39.37 80.15,43.18 80.15,45.72 81.42,46.99 81.42,59.69 IC8.17
  Bottom 0.152: v97.93,20.32 v83.96,20.32 v39.51,20.32 | v83.96,39.37 100.47,39.37 104.28,35.56 IC7.5
D4  (via drill 0.3)
  Top 0.152: v39.51,34.29 39.51,31.75 36.97,29.21 IC1.35 | IC8.18 78.88,59.69 77.61,58.42 v77.61,35.56 v77.61,19.05 | v99.2,17.78 99.2,13.97 100.47,12.7 IC3.6
  Bottom 0.152: v39.51,34.29 40.78,35.56 v77.61,35.56 89.04,35.56 91.58,38.1 99.2,38.1 101.74,35.56 IC7.6 | v99.2,17.78 97.93,19.05 v77.61,19.05
D5  (via drill 0.3)
  Top 0.152: v97.93,16.51 97.93,12.7 IC3.7 | v86.5,34.29 v86.5,17.78 | v75.07,34.29 75.07,45.72 76.34,46.99 76.34,59.69 IC8.19
  Bottom 0.152: IC1.34 39.51,29.21 44.59,34.29 v75.07,34.29 v86.5,34.29 89.04,34.29 91.58,36.83 97.93,36.83 99.2,35.56 IC7.7 | v97.93,16.51 96.66,17.78 v86.5,17.78
D6  (via drill 0.3)
  Top 0.152: v42.05,17.78 42.05,29.21 IC1.33 | v92.85,16.51 95.39,13.97 95.39,12.7 IC3.8 | v73.8,17.78 73.8,30.48 72.53,31.75 72.53,45.72 73.8,46.99 73.8,59.69 IC8.20 | v92.85,44.45 92.85,39.37 96.66,35.56 IC7.8 | v90.31,45.72 89.04,46.99 v89.04,58.42
  Bottom 0.152: v42.05,17.78 v73.8,17.78 85.23,17.78 86.5,16.51 v92.85,16.51 | v92.85,44.45 91.58,45.72 v90.31,45.72 | v89.04,58.42 76.34,58.42 75.07,59.69 73.8,59.69 IC8.20
D7  (via drill 0.3)
  Top 0.152: v91.58,31.75 94.12,34.29 IC7.9 | v89.04,31.75 v89.04,15.24 | v68.72,57.15 71.26,59.69 IC8.21 | v64.91,57.15 62.37,54.61 62.37,44.45 63.64,43.18 v63.64,31.75
  Bottom 0.152: v91.58,31.75 v89.04,31.75 v63.64,31.75 47.13,31.75 44.59,29.21 IC1.32 | v89.04,15.24 90.31,15.24 92.85,12.7 IC3.9 | v64.91,57.15 v68.72,57.15
GND  (via drill 0.3)
  Top 0.711: X4.3 11.57,5.08 14.11,2.54 19.19,2.54 19.19,21.59 C5.1 | 91.58,44.45 91.58,52.07 94.12,54.61 IC9.8 94.12,55.88 95.39,57.15 v95.39,67.31 | 91.58,44.45 91.58,35.56 IC7.10 | 72.53,13.97 72.53,12.7 69.99,10.16 QG1.2 | IC8.16 81.42,44.45 85.23,40.64 85.23,19.05 82.69,16.51 82.69,12.7 83.96,11.43 90.31,11.43 IC3.10 | v87.77,44.45 91.58,44.45 | v64.91,21.59 72.53,13.97 | 72.53,13.97 IC1.20 | v39.51,41.91 39.51,53.34 C1.1 | 68.72,72.39 68.72,78.74 JP6.2 68.72,80.01 71.26,82.55 v90.31,82.55 | 68.72,72.39 68.72,60.96 IC8.22 | 68.72,72.39 64.91,72.39 | IC4.8 11.57,46.99 14.11,44.45 14.11,40.64 IC4.10 | 50.94,80.01 50.94,76.2 44.59,69.85 R7.2 | C12.2 9.03,59.69 7.76,60.96 7.76,69.85 C13.1 | 64.91,72.39 56.02,81.28 50.94,81.28 50.94,80.01 | 64.91,72.39 R8.2 | 50.94,80.01 JP1.3 | C16.1 33.16,40.64 35.7,43.18 35.7,58.42 28.08,66.04 R6.2 | v136.03,13.97 136.03,8.89 137.3,7.62 R17.2 | C3.1 116.98,7.62 119.52,10.16 v119.52,15.24 119.52,26.67 118.25,27.94 C15.1 | v115.71,30.48 115.71,33.02 114.44,34.29 IC7.1 114.44,35.56 114.44,41.91 109.36,46.99 IC9.15 109.36,48.26 v109.36,53.34 | 99.2,67.31 99.2,74.93 103.01,78.74 SV1.2 | 115.71,54.61 115.71,67.31 116.98,68.58 IC6.2 | v130.95,35.56 v130.95,57.15 130.95,58.42 129.68,59.69 129.68,72.39 133.49,76.2 C2.- | 99.2,67.31 103.01,67.31 115.71,54.61 | C4.1 99.2,67.31 | 115.71,54.61 C17.1
  Bottom 0.711: X2.-1 3.95,20.32 5.22,21.59 17.92,21.59 C5.1 19.19,21.59 v64.91,21.59 | IC3.10 90.31,12.7 89.04,13.97 72.53,13.97 IC1.20 | v87.77,44.45 81.42,44.45 IC8.16 | 33.16,40.64 31.89,41.91 28.08,41.91 26.81,40.64 IC4.15 | v39.51,41.91 38.24,40.64 33.16,40.64 | C16.1 33.16,40.64 | 3.95,46.99 1.41,44.45 SV3.6 | 3.95,46.99 11.57,46.99 IC4.8 | 28.08,66.04 21.73,72.39 20.46,72.39 17.92,69.85 | 2.68,69.85 2.68,81.28 C11.- | 7.76,69.85 2.68,69.85 | 17.92,69.85 15.38,72.39 10.3,72.39 7.76,69.85 | 17.92,69.85 IC5.2 | 7.76,69.85 C13.1 | 28.08,66.04 30.62,66.04 33.16,68.58 43.32,68.58 44.59,69.85 R7.2 | 28.08,66.04 R6.2 | 3.95,46.99 1.41,49.53 1.41,69.85 2.68,69.85 | 129.68,15.24 v119.52,15.24 115.71,15.24 113.17,12.7 IC3.1 | 129.68,15.24 129.68,20.32 R15.1 | v136.03,13.97 134.76,15.24 129.68,15.24 | v115.71,30.48 118.25,27.94 C15.1 | 104.28,77.47 106.82,77.47 108.09,78.74 SV1.4 | 104.28,77.47 103.01,78.74 SV1.2 | v130.95,35.56 132.22,35.56 132.22,33.02 R16.2 | v130.95,57.15 134.76,57.15 SV2.6 | 133.49,66.04 132.22,67.31 132.22,76.2 133.49,76.2 C2.- | 133.49,66.04 134.76,64.77 SV2.3 | 133.49,66.04 116.98,66.04 116.98,68.58 IC6.2 | v109.36,53.34 114.44,53.34 115.71,54.61 C17.1 | v90.31,82.55 95.39,77.47 104.28,77.47 | v95.39,67.31 99.2,67.31 C4.1
GREEN
  Top 0.152: R7.1 31.89,69.85 31.89,80.01 33.16,81.28 40.78,81.28 40.78,80.01 JP1.8
  Bottom 0.152: R3.1 78.88,77.47 80.15,78.74 80.15,80.01 75.07,80.01 69.99,74.93 36.97,74.93 31.89,69.85 R7.1
KBDCLK
  Bottom 0.152: IC1.12 52.21,13.97 44.59,6.35 14.11,6.35 X4.5
KBDDATA
  Bottom 0.152: IC1.3 29.35,13.97 23,7.62 11.57,7.62 X4.1
MISO  (via drill 0.3)
  Top 0.152: v40.78,24.13 40.78,15.24 39.51,13.97 IC1.7 | v123.33,53.34 v123.33,25.4 | v6.49,71.12 6.49,41.91 3.95,39.37 SV3.1 | v52.21,77.47 58.56,71.12 v58.56,62.23
  Bottom 0.152: v40.78,24.13 80.15,24.13 81.42,25.4 v123.33,25.4 | v123.33,53.34 124.6,54.61 127.14,54.61 | 127.14,54.61 134.76,54.61 SV2.7 | v6.49,71.12 9.03,73.66 24.27,73.66 28.08,77.47 v52.21,77.47 | v58.56,62.23 130.95,62.23 132.22,60.96 132.22,58.42 130.95,58.42 127.14,54.61
MOSI  (via drill 0.3)
  Top 0.152: v28.08,24.13 28.08,22.86 36.97,13.97 IC1.6 | v15.38,26.67 12.84,29.21 v12.84,35.56 12.84,40.64 v11.57,41.91 | v124.6,53.34 123.33,54.61 v123.33,63.5 | v94.12,63.5 91.58,60.96 v91.58,59.69 | v52.21,57.15 40.78,45.72 v40.78,36.83
  Bottom 0.152: 132.22,45.72 133.49,44.45 136.03,44.45 136.03,40.64 132.22,36.83 128.41,36.83 128.41,33.02 R13.1 | v28.08,24.13 17.92,24.13 v15.38,26.67 | v11.57,41.91 7.76,45.72 3.95,45.72 2.68,44.45 2.68,41.91 1.41,41.91 SV3.4 | v124.6,53.34 132.22,45.72 | v94.12,63.5 v123.33,63.5 | v91.58,59.69 87.77,55.88 59.83,55.88 58.56,57.15 v52.21,57.15 | v40.78,36.83 36.97,36.83 35.7,35.56 v12.84,35.56 | 132.22,45.72 R16.1
MOSI1
  Top 0.152: R13.2 128.41,45.72 128.41,77.47 133.49,82.55 136.03,82.55 136.03,77.47 137.3,76.2 137.3,68.58 136.03,67.31 SV2.2
N$1
  Top 0.711: 10.3,78.74 15.38,73.66 15.38,69.85 IC5.1 | 10.3,78.74 7.76,81.28 C11.+ | 10.3,78.74 10.3,27.94 12.84,25.4 X2.+
N$2
  Top 0.152: R10.2 64.91,68.58 54.75,78.74 54.75,80.01 JP1.1
N$3
  Top 0.152: R19.1 108.09,73.66 105.55,76.2 105.55,78.74 SV1.3
N$4  (via drill 0.3)
  Top 0.152: v17.92,16.51 16.65,17.78 16.65,21.59 20.46,25.4 20.46,29.21 15.38,34.29 v15.38,41.91
  Bottom 0.152: v17.92,16.51 31.89,16.51 34.43,13.97 IC1.5 | v15.38,41.91 17.92,44.45 19.19,44.45 20.46,45.72 20.46,50.8 21.73,50.8 R9.1
N$5
  Top 0.711: IC5.3 20.46,69.85 17.92,72.39 17.92,78.74 S2.2
  Bottom 0.711: 17.92,78.74 14.11,74.93 7.76,74.93 C13.2 | 17.92,78.74 17.92,80.01 20.46,82.55 71.26,82.55 71.26,80.01 JP6.1 | 17.92,78.74 S2.2
N$7  (via drill 0.3)
  Top 0.152: v16.65,55.88 24.27,63.5 v24.27,72.39 | v69.99,76.2 77.61,68.58 v77.61,64.77 | v101.74,66.04 111.9,55.88 IC9.1
  Bottom 0.152: v16.65,55.88 15.38,55.88 15.38,44.45 11.57,40.64 IC4.9 | v24.27,72.39 28.08,76.2 v69.99,76.2 | v77.61,64.77 78.88,66.04 v101.74,66.04
N$9
  Top 0.152: IC1.19 69.99,13.97 68.72,12.7 68.72,3.81 69.99,2.54 QG1.3
N$10  (via drill 0.3)
  Top 0.152: v111.9,13.97 111.9,11.43 110.63,10.16 110.63,5.08 IC3.19 | v128.41,16.51 130.95,19.05 130.95,34.29 132.22,35.56 v132.22,38.1 | v116.98,41.91 113.17,45.72 113.17,50.8 109.36,54.61 IC9.2
  Bottom 0.152: v111.9,13.97 114.44,16.51 v128.41,16.51 | v132.22,38.1 128.41,41.91 v116.98,41.91
N$11  (via drill 0.3)
  Top 0.152: v14.11,15.24 7.76,21.59 v7.76,30.48 | v23,34.29 24.27,35.56 24.27,36.83 25.54,38.1 25.54,44.45 26.81,45.72 26.81,46.99 IC4.2
  Bottom 0.152: v14.11,15.24 23,15.24 24.27,13.97 IC1.1 | v7.76,30.48 11.57,34.29 v23,34.29
N$12  (via drill 0.3)
  Top 0.152: v9.03,30.48 v9.03,49.53 | v25.54,25.4 26.81,24.13 26.81,13.97 IC1.2
  Bottom 0.152: v9.03,49.53 12.84,49.53 14.11,50.8 R11.1 | v9.03,30.48 11.57,27.94 20.46,27.94 23,25.4 v25.54,25.4
N$15  (via drill 0.3)
  Top 0.152: v125.87,46.99 127.14,45.72 127.14,43.18 129.68,40.64 129.68,24.13 v128.41,22.86 | v115.71,21.59 114.44,20.32 114.44,8.89 111.9,6.35 111.9,3.81 110.63,2.54 108.09,2.54 108.09,3.81 IC3.18
  Bottom 0.152: v125.87,46.99 114.44,58.42 104.28,58.42 101.74,55.88 IC9.5 | v128.41,22.86 127.14,21.59 v115.71,21.59
N$20  (via drill 0.3)
  Top 0.152: v103.01,39.37 103.01,43.18 99.2,46.99 IC9.11 | v125.87,12.7 v125.87,39.37 | v108.09,10.16 105.55,7.62 105.55,5.08 IC3.17
  Bottom 0.152: v125.87,39.37 v103.01,39.37 | v125.87,12.7 123.33,10.16 v108.09,10.16
N$21  (via drill 0.3)
  Top 0.152: v104.28,13.97 104.28,6.35 103.01,5.08 IC3.16 | v123.33,17.78 124.6,19.05 v124.6,40.64 | v110.63,40.64 106.82,44.45 106.82,46.99 IC9.14
  Bottom 0.152: v104.28,13.97 108.09,17.78 v123.33,17.78 | v124.6,40.64 v110.63,40.64
N$22  (via drill 0.3)
  Top 0.152: v129.68,11.43 132.22,13.97 v132.22,30.48 | v120.79,36.83 119.52,38.1 v119.52,52.07
  Bottom 0.152: v129.68,11.43 120.79,2.54 101.74,2.54 100.47,3.81 IC3.15 | v132.22,30.48 127.14,30.48 v120.79,36.83 | v119.52,52.07 114.44,57.15 108.09,57.15 106.82,55.88 IC9.3
N$23  (via drill 0.3)
  Top 0.152: v95.39,8.89 95.39,7.62 97.93,5.08 IC3.14 | v83.96,10.16 78.88,15.24 v78.88,36.83 | v66.18,38.1 64.91,39.37 v64.91,49.53 | v92.85,49.53 99.2,55.88 IC9.6
  Bottom 0.152: v95.39,8.89 94.12,10.16 v83.96,10.16 | v78.88,36.83 77.61,38.1 v66.18,38.1 | v64.91,49.53 v92.85,49.53
N$24  (via drill 0.3)
  Top 0.152: v29.35,2.54 21.73,10.16 21.73,24.13 23,25.4 v23,26.67 | v26.81,33.02 33.16,39.37 36.97,39.37 v36.97,63.5 | v122.06,64.77 122.06,45.72 120.79,44.45 v120.79,43.18 | v99.2,44.45 96.66,46.99 IC9.10
  Bottom 0.152: v29.35,2.54 53.48,2.54 56.02,5.08 77.61,5.08 80.15,2.54 94.12,2.54 95.39,3.81 IC3.13 | v23,26.67 20.46,29.21 16.65,29.21 15.38,30.48 15.38,33.02 v26.81,33.02 | v36.97,63.5 40.78,67.31 75.07,67.31 77.61,69.85 111.9,69.85 116.98,64.77 v122.06,64.77 | v120.79,43.18 119.52,44.45 v99.2,44.45
N$25  (via drill 0.3)
  Top 0.152: v115.71,8.89 118.25,11.43 118.25,26.67 116.98,27.94 v116.98,35.56 | v105.55,38.1 104.28,39.37 104.28,46.99 IC9.13
  Bottom 0.152: v115.71,8.89 96.66,8.89 92.85,5.08 IC3.12 | v116.98,35.56 114.44,38.1 v105.55,38.1
N$26
  Top 0.152: R2.2 91.58,76.2 97.93,69.85 97.93,62.23 104.28,55.88 IC9.4
N$27
  Top 0.152: R3.2 96.66,69.85 96.66,55.88 IC9.7
N$29  (via drill 0.3)
  Top 0.152: v90.31,48.26 90.31,66.04 R5.2
  Bottom 0.152: v90.31,48.26 94.12,48.26 IC9.9
N$30  (via drill 0.3)
  Top 0.152: R4.2 87.77,67.31 v87.77,52.07 | v97.93,52.07 101.74,48.26 IC9.12
  Bottom 0.152: v87.77,52.07 v97.93,52.07
PE0  (via drill 0.3)
  Top 0.152: v47.13,46.99 47.13,29.21 IC1.31
  Bottom 0.152: v47.13,46.99 29.35,46.99 IC4.1
PE1  (via drill 0.3)
  Top 0.152: v52.21,25.4 49.67,27.94 49.67,29.21 IC1.30
  Bottom 0.152: v52.21,25.4 73.8,25.4 75.07,26.67 91.58,26.67 IC7.11
PE2
  Top 0.152: IC3.11 90.31,5.08 76.34,5.08 76.34,12.7 62.37,26.67 52.21,26.67 52.21,29.21 IC1.29
RD  (via drill 0.3)
  Top 0.152: v63.64,64.77 63.64,60.96 IC8.24 | v72.53,64.77 75.07,62.23 v75.07,50.8 | v122.06,44.45 122.06,5.08 118.25,1.27 64.91,1.27 64.91,13.97 IC1.17
  Bottom 0.152: v72.53,64.77 v63.64,64.77 | v75.07,50.8 115.71,50.8 v122.06,44.45
RED
  Top 0.152: R8.1 52.21,72.39 48.4,68.58 40.78,68.58 40.78,77.47 39.51,78.74 39.51,80.01 JP1.9
  Bottom 0.152: R2.1 73.8,73.66 54.75,73.66 53.48,72.39 52.21,72.39 R8.1
RESET  (via drill 0.3)
  Top 0.152: SV3.5 3.95,44.45 5.22,45.72 5.22,62.23 3.95,63.5 R1.1 | v85.23,16.51 87.77,13.97 89.04,13.97 90.31,15.24 v90.31,41.91 | v86.5,41.91 83.96,44.45 83.96,52.07 82.69,53.34 82.69,71.12 91.58,80.01 100.47,80.01 | 100.47,80.01 100.47,82.55 108.09,82.55 109.36,81.28 109.36,72.39 104.28,67.31 C4.2 | 100.47,80.01 SV1.1
  Bottom 0.152: 9.03,54.61 3.95,54.61 3.95,63.5 R1.1 | v85.23,16.51 47.13,16.51 44.59,13.97 IC1.9 | v86.5,41.91 v90.31,41.91 | 9.03,54.61 15.38,60.96 42.05,60.96 44.59,63.5 92.85,63.5 94.12,64.77 101.74,64.77 104.28,67.31 C4.2 | 9.03,54.61 C12.1
S0  (via drill 0.3)
  Top 0.152: v43.32,25.4 43.32,24.13 54.75,24.13 56.02,22.86 56.02,17.78 59.83,13.97 IC1.15 | v20.46,30.48 17.92,33.02 17.92,50.8 R18.1
  Bottom 0.152: v43.32,25.4 26.81,25.4 25.54,26.67 24.27,26.67 v20.46,30.48
SCK  (via drill 0.3)
  Top 0.152: 137.3,20.32 136.03,21.59 136.03,33.02 R14.1 | 39.51,11.43 29.35,1.27 11.57,1.27 11.57,3.81 10.3,5.08 10.3,10.16 5.22,15.24 5.22,19.05 6.49,20.32 6.49,34.29 2.68,38.1 2.68,39.37 3.95,40.64 SV3.3 | 39.51,11.43 42.05,13.97 IC1.8 | 137.3,20.32 134.76,17.78 134.76,13.97 129.68,8.89 124.6,8.89 v124.6,17.78 | v92.85,15.24 91.58,13.97 v91.58,8.89 | 39.51,11.43 v50.94,11.43 | 137.3,20.32 R17.1
  Bottom 0.152: v124.6,17.78 123.33,19.05 101.74,19.05 97.93,15.24 v92.85,15.24 | v91.58,8.89 90.31,7.62 56.02,7.62 52.21,11.43 v50.94,11.43
SCK1
  Top 0.152: R14.2 136.03,45.72 133.49,48.26 133.49,58.42 134.76,59.69 SV2.5
SYNC
  Top 0.152: R9.2 21.73,63.5 15.38,57.15 15.38,55.88 16.65,54.61 17.92,54.61 17.92,55.88 25.54,63.5 25.54,76.2 31.89,82.55 43.32,82.55 43.32,80.01 JP1.7
V33
  Top 0.152: SV2.4 134.76,62.23 133.49,63.5 133.49,73.66 136.03,76.2 133.49,78.74 133.49,81.28 C2.+
  Bottom 0.152: IC6.1 119.52,67.31 133.49,81.28 C2.+
WR  (via drill 0.3)
  Top 0.152: v86.5,57.15 86.5,43.18 87.77,41.91 87.77,17.78 86.5,16.51 85.23,17.78 83.96,16.51 83.96,13.97 v85.23,12.7
  Bottom 0.152: v86.5,57.15 76.34,57.15 75.07,58.42 52.21,58.42 50.94,59.69 IC8.29 | v85.23,12.7 73.8,12.7 69.99,8.89 67.45,8.89 62.37,13.97 IC1.16
(copper drawn outside any net)
  shapes: Top circle x1